# Altium schematic sheet l5.schdoc
size 83 x 120 mm
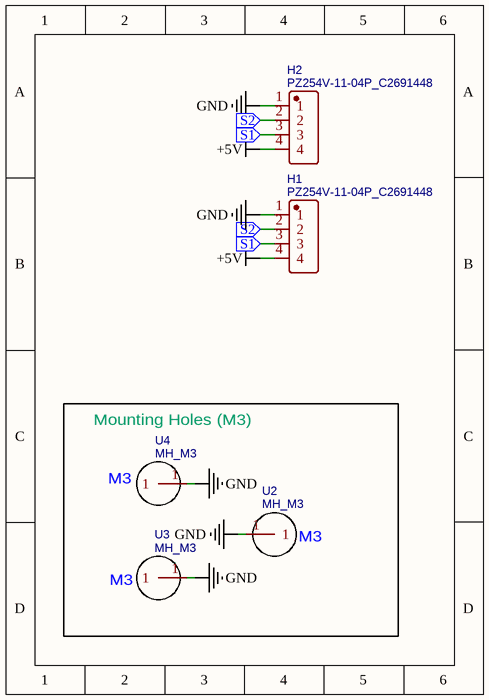
[diagram p0: l5.schdoc]

## Parts
H1  PZ254V-11-04P_C2691448  [HDR-TH_4P-P2.54-V-M]
H2  PZ254V-11-04P_C2691448  [HDR-TH_4P-P2.54-V-M]
U2  MH_M3  [MH_M3_PCB]
U3  MH_M3  [MH_M3_PCB]
U4  MH_M3  [MH_M3_PCB]

## Blocks framed on the sheet
Mounting Holes (M3): U2-U4

## Ports
S1 (in), S2 (in)

## Nets
+5V: H1.4 H2.4
GND: H1.1 H2.1 U2.1 U3.1 U4.1
S1: H1.3 H2.3 ; port S1
S2: H1.2 H2.2 ; port S2

## Notes on the sheet
- (in symbol MH_M3) M3

## Library data of the parts
H1 H2 = PZ254V-11-04P_C2691448: Manufacturer: XFCN(兴飞); Contributor: LCSC; Supplier: LCSC; Supplier Part: C2691448; Manufacturer Part: PZ254V-11-04P; JLCPCB Part Class: Extended Part; spicePre: H; spiceSymbolName: PZ254V-11-04P_C2691448
U2-U4 = MH_M3: Contributor: js314dev; spicePre: U; spiceSymbolName: MH_M3